# EAGLE design open-lux-R (EAGLE 6.5.0)
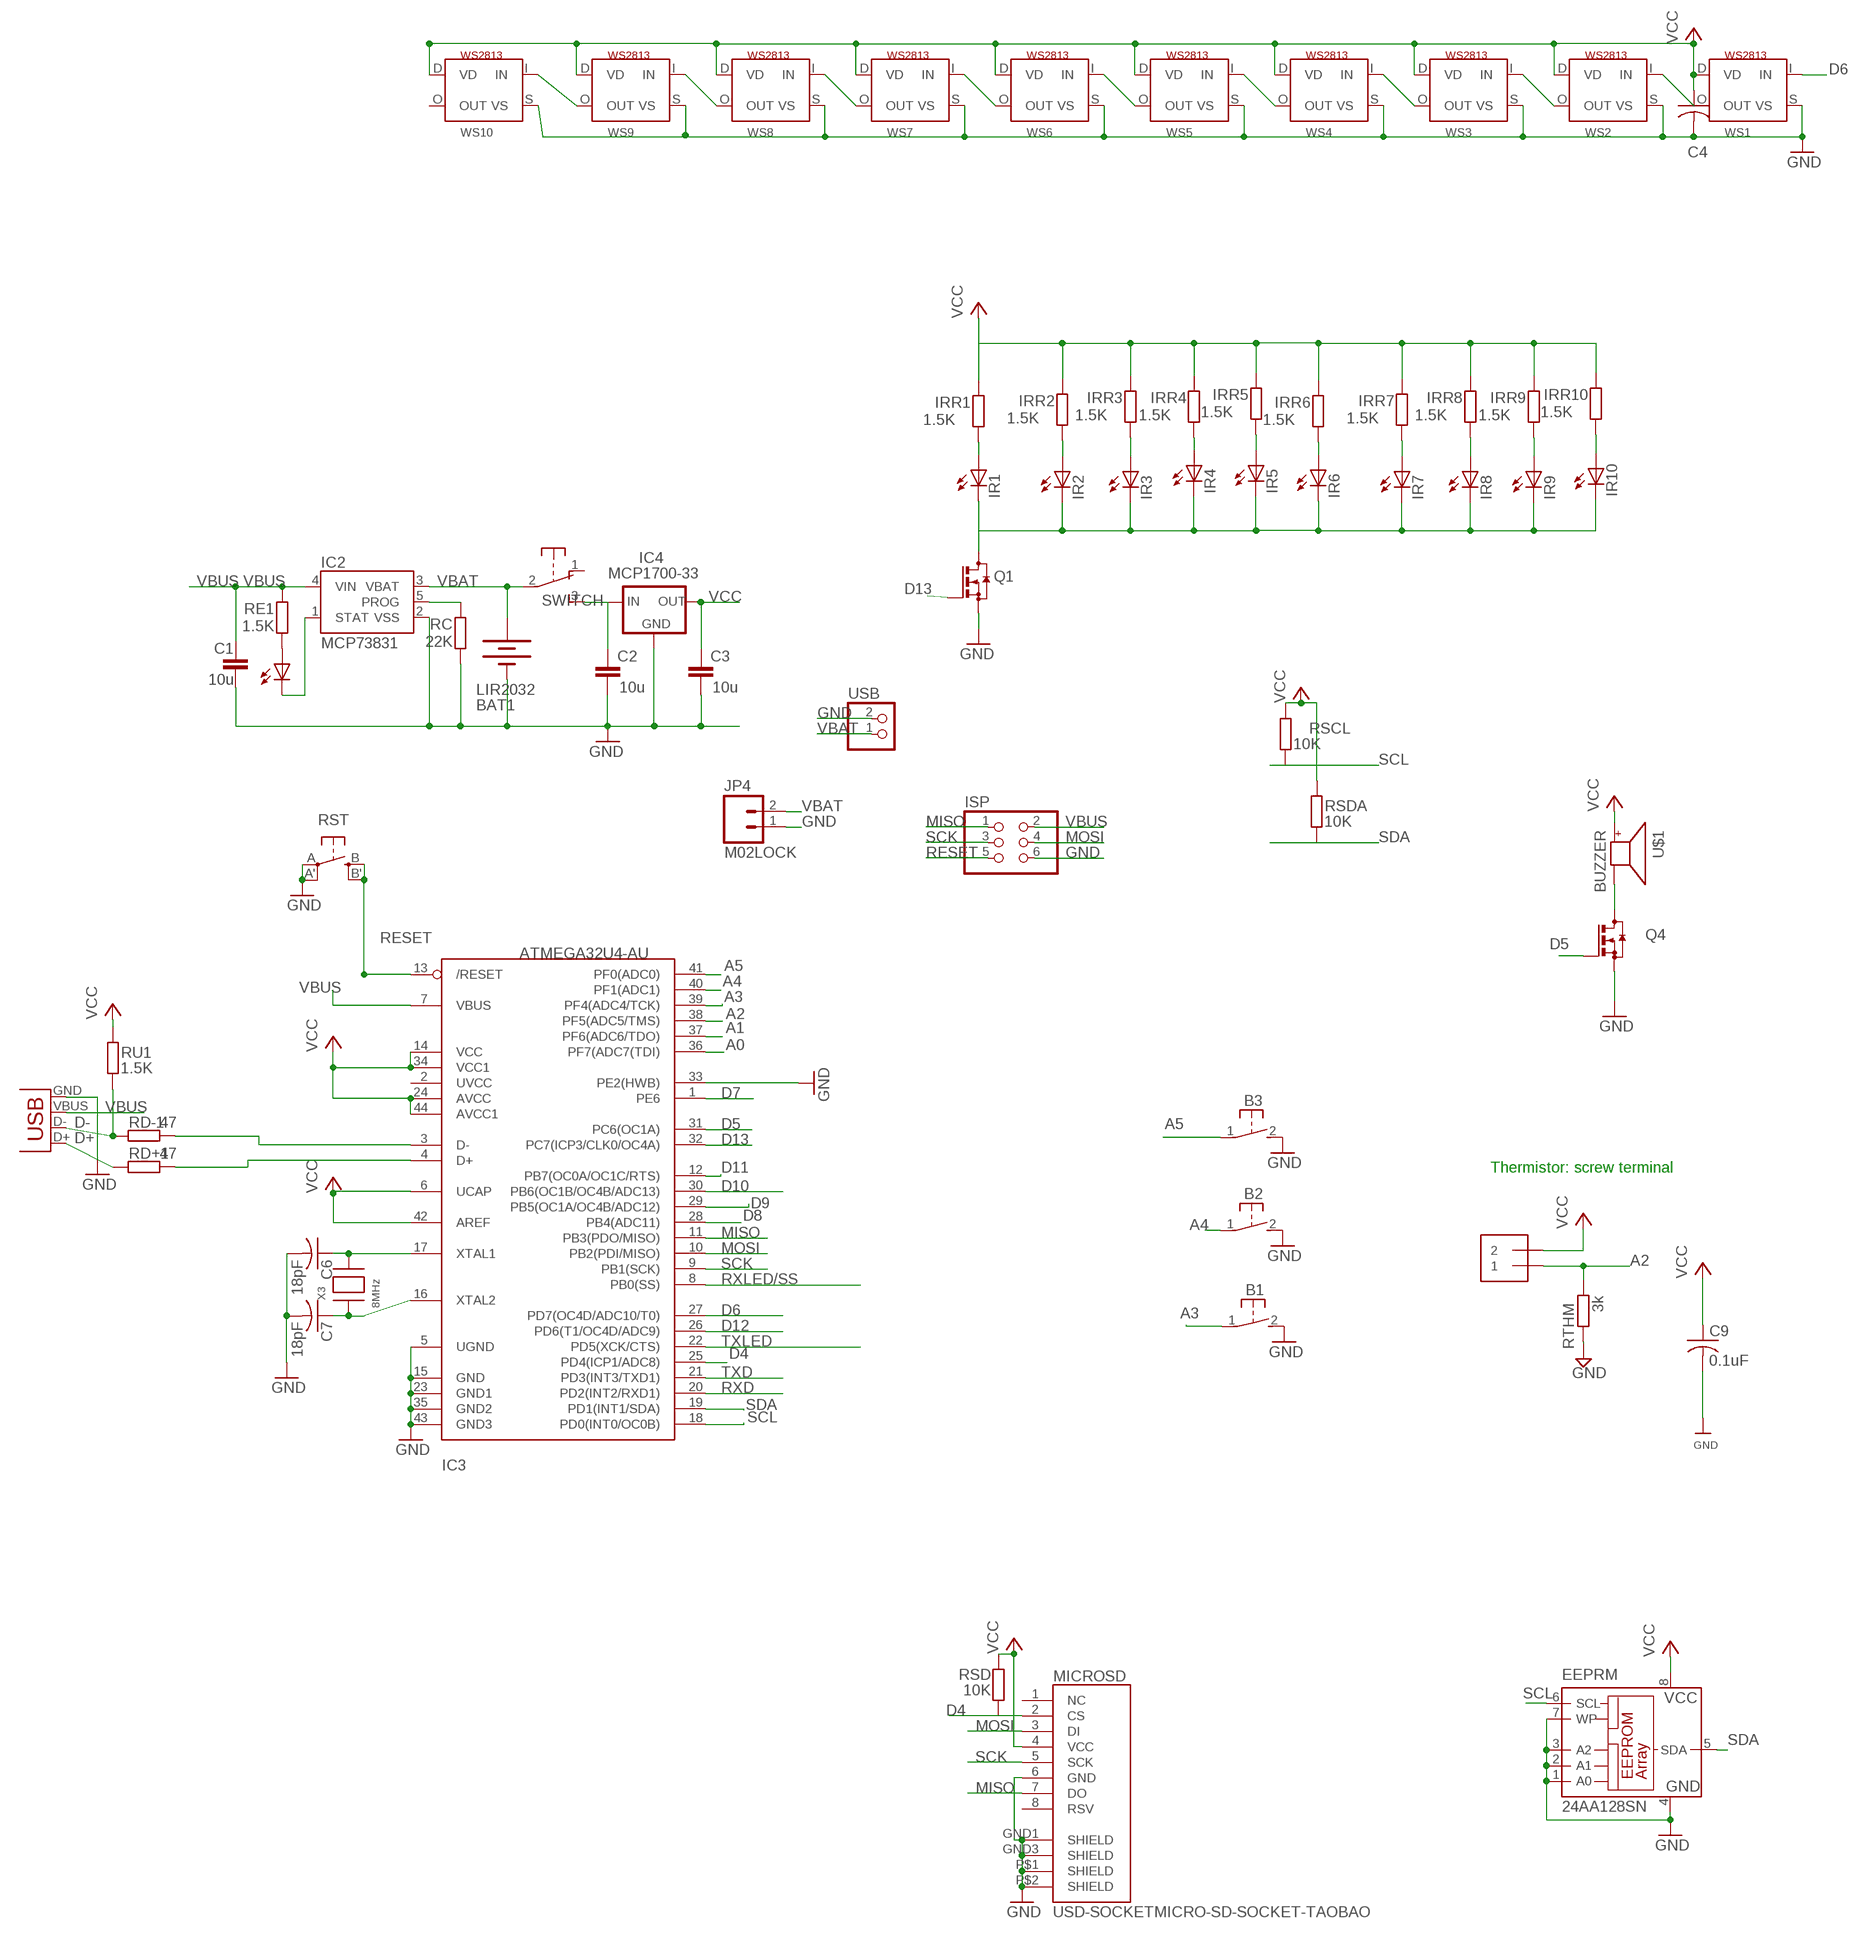
[diagram p0: schematic, sheet 1, part 1 of 2]
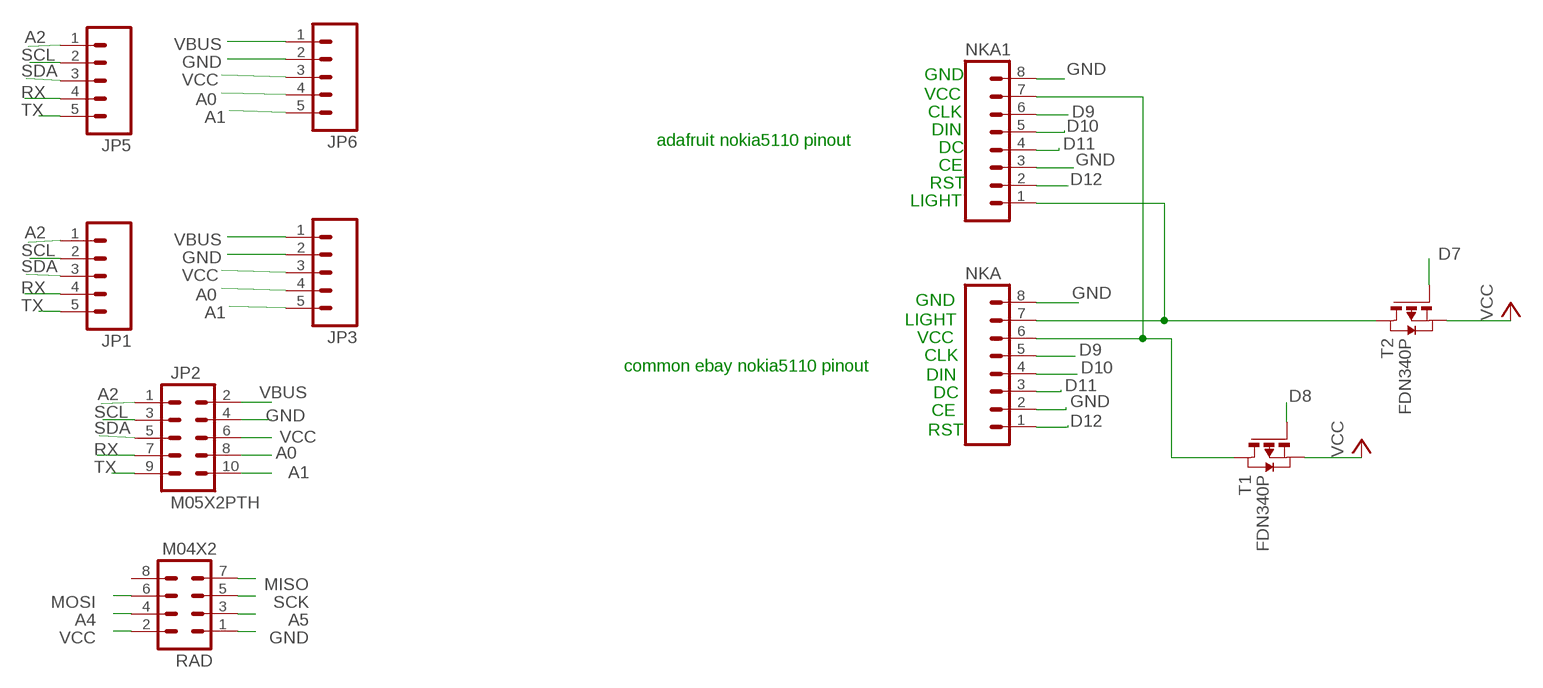
[diagram p1: schematic, sheet 1, part 2 of 2]

## Parts
B1  31-XX  [B3F-31XX]
B2  31-XX  [B3F-31XX]
B3  31-XX  [B3F-31XX]
BAT1  LIR2032  BATTERYBATTCOM_20MM_PTH_SMT  [BATTCOM_20MM_PTH_SMT]
C1  10u  C-EUC0805  [C0805]
C2  10u  C-EUC0805  [C0805]
C3  10u  C-EUC0805  [C0805]
C4  C-USC0805K  [C0805K]
C6  18pF  C-USC0805K  [C0805K]
C7  18pF  C-USC0805K  [C0805K]
C9  0.1uF  C-USC0805  [C0805]
EEPRM  24AA128SN  [SO-08]
IC2  MCP73831  [SOT23-5]
IC3  ATMEGA32U4-AU  [TQFP44]
IC4  MCP1700-33  MCP1700SOT233  [SOT23]
IR1  LEDCHIP-LED0603  [CHIP-LED0603]
IR2  LEDCHIP-LED0603  [CHIP-LED0603]
IR3  LEDCHIP-LED0603  [CHIP-LED0603]
IR4  LEDCHIP-LED0603  [CHIP-LED0603]
IR5  LEDCHIP-LED0603  [CHIP-LED0603]
IR6  LEDCHIP-LED0603  [CHIP-LED0603]
IR7  LEDCHIP-LED0603  [CHIP-LED0603]
IR8  LEDCHIP-LED0603  [CHIP-LED0603]
IR9  LEDCHIP-LED0603  [CHIP-LED0603]
IR10  LEDCHIP-LED0603  [CHIP-LED0603]
IRR1  1.5K  R-EU_R0805  [R0805]
IRR2  1.5K  R-EU_R0805  [R0805]
IRR3  1.5K  R-EU_R0805  [R0805]
IRR4  1.5K  R-EU_R0805  [R0805]
IRR5  1.5K  R-EU_R0805  [R0805]
IRR6  1.5K  R-EU_R0805  [R0805]
IRR7  1.5K  R-EU_R0805  [R0805]
IRR8  1.5K  R-EU_R0805  [R0805]
IRR9  1.5K  R-EU_R0805  [R0805]
IRR10  1.5K  R-EU_R0805  [R0805]
ISP  PINHD-2X3  [2X03]
JP1  M05LOCK  [1X05_LOCK]
JP2  M05X2PTH  [AVR_ICSP]
JP3  M05LOCK  [1X05_LOCK]
JP4  M02LOCK  [1X02_LOCK]
JP5  M05LOCK  [1X05_LOCK]
JP6  M05LOCK  [1X05_LOCK]
MICROSD  USD-SOCKETMICRO-SD-SOCKET-TAOBAO  [MICRO-SD-SOCKET-TAOBAO]
NKA  M08LOCK  [1X08_LOCK]
NKA1  M08LOCK  [1X08_LOCK]
PWR  0805  LEDCHIPLED_0805  [CHIPLED_0805]
Q1  BSS123  [SOT23]
Q4  BSS123  [SOT23]
RAD  M04X2  [2X4]
RC  22K  R-EU_R0805  [R0805]
RD+1  47  R-EU_R0805  [R0805]
RD-1  47  R-EU_R0805  [R0805]
RE1  1.5K  R-EU_R0805  [R0805]
RSCL  10K  R-EU_R0805  [R0805]
RSD  10K  R-EU_R0805  [R0805]
RSDA  10K  R-EU_R0805  [R0805]
RST  EVQQ2  [EVQ-Q2]
RTHM  3k  R-EU_0204/7  [0204/7]
RU1  1.5K  R-EU_R0805  [R0805]
SWITCH  EG1206  [EG1206]
T1  FDN340P  PMOSSOT23  [SOT-23]
T2  FDN340P  PMOSSOT23  [SOT-23]
THM1  1X2-3.5MM  [1X2-3.5MM]
U$1  BUZZER  [SMT-8585-BUZZER]
USB  JST_2PIN-SMT-RA  [JST-PH-2-SMT-RA]
WS1  WS2813  [RGBLED5050_4]
WS2  WS2813  [RGBLED5050_4]
WS3  WS2813  [RGBLED5050_4]
WS4  WS2813  [RGBLED5050_4]
WS5  WS2813  [RGBLED5050_4]
WS6  WS2813  [RGBLED5050_4]
WS7  WS2813  [RGBLED5050_4]
WS8  WS2813  [RGBLED5050_4]
WS9  WS2813  [RGBLED5050_4]
WS10  WS2813  [RGBLED5050_4]
X2  USBSMD  [USB-MINIB]
X3  8MHz  XTALNX5032  [NX5032]

## Nets
A0: IC3.36(PF7(ADC7(TDI)) JP2.8 JP3.4 JP6.4
A1: IC3.37(PF6(ADC6/TDO)) JP2.10 JP3.5 JP6.5
A2: IC3.38(PF5(ADC5/TMS)) JP1.1 JP2.1 JP5.1 RTHM.2 THM1.1
A3: B1.1(P) IC3.39(PF4(ADC4/TCK))
A4: B2.1(P) IC3.40(PF1(ADC1)) RAD.4
A5: B3.1(P) IC3.41(PF0(ADC0)) RAD.3
D4: IC3.25(PD4(ICP1/ADC8)) MICROSD.2(CS) RSD.1
D5: IC3.31(PC6(OC1A)) Q4.1(G)
D6: IC3.27(PD7(OC4D/ADC10/T0)) WS1.I(IN)
D7: IC3.1(PE6) T2.3(G)
D8: IC3.28(PB4(ADC11)) T1.3(G)
D9: IC3.29(PB5(OC1A/OC4B/ADC12)) NKA1.6 NKA.5
D10: IC3.30(PB6(OC1B/OC4B/ADC13)) NKA1.5 NKA.4
D11: IC3.12(PB7(OC0A/OC1C/RTS)) NKA1.4 NKA.3
D12: IC3.26(PD6(T1/OC4D/ADC9)) NKA1.2 NKA.1
D13: IC3.32(PC7(ICP3/CLK0/OC4A)) Q1.1(G)
D+: RD+1.1 X2.D+
D-: RD-1.1 RU1.1 X2.D-
GND: B1.2(S) B2.2(S) B3.2(S) BAT1.P$1(-) C1.2 C2.2 C3.2 C4.2 C6.2 C7.2 C9.2 EEPRM.1(A0) EEPRM.2(A1) EEPRM.3(A2) EEPRM.4(GND) EEPRM.7(WP) IC2.2(VSS) IC3.5(UGND) IC3.15(GND) IC3.23(GND1) IC3.33(PE2(HWB)) IC3.35(GND2) IC3.43(GND3) IC4.1(GND) ISP.6 JP2.4 JP3.2 JP4.1 JP6.2 MICROSD.6(GND) MICROSD.GND1(SHIELD) MICROSD.GND3(SHIELD) MICROSD.P$1(SHIELD) MICROSD.P$2(SHIELD) NKA1.3 NKA1.8 NKA.2 NKA.8 Q1.2(S) Q4.2(S) RAD.1 RC.1 RST.A'(P1) RST.A(P) RTHM.1 USB.2 WS1.S(VS) WS2.S(VS) WS3.S(VS) WS4.S(VS) WS5.S(VS) WS6.S(VS) WS7.S(VS) WS8.S(VS) WS9.S(VS) WS10.S(VS) X2.GND
MISO: IC3.11(PB3(PDO/MISO)) ISP.1 MICROSD.7(DO) RAD.7
MOSI: IC3.10(PB2(PDI/MISO)) ISP.4 MICROSD.3(DI) RAD.6
N$1: C2.1 IC4.3(IN) SWITCH.3(S)
N$2: C7.1 IC3.16(XTAL2) X3.P$1
N$3: C6.1 IC3.17(XTAL1) X3.P$2
N$4: WS9.O(OUT) WS10.I(IN)
N$5: IC2.1(STAT) PWR.C
N$6: IC2.5(PROG) RC.2
N$7: Q4.3(D) U$1.-
N$8: IR1.C IR2.C IR3.C IR4.C IR5.C IR6.C IR7.C IR8.C IR9.C IR10.C Q1.3(D)
N$9: T2.1(D)
N$10: PWR.A RE1.1
N$11: IR1.A IRR1.1
N$12: NKA1.1 NKA.7
N$13: IR2.A IRR2.1
N$14: WS6.O(OUT) WS7.I(IN)
N$15: IR3.A IRR3.1
N$16: IR6.A IRR6.1
N$17: IR4.A IRR4.1
N$18: IR5.A IRR5.1
N$19: WS4.O(OUT) WS5.I(IN)
N$20: WS5.O(OUT) WS6.I(IN)
N$21: IC3.4(D+) RD+1.2
N$22: IC3.3(D-) RD-1.2
N$23: WS1.O(OUT) WS2.I(IN)
N$24: WS2.O(OUT) WS3.I(IN)
N$25: WS3.O(OUT) WS4.I(IN)
N$26: IR7.A IRR7.1
N$27: WS8.O(OUT) WS9.I(IN)
N$28: WS7.O(OUT) WS8.I(IN)
N$29: IR8.A IRR8.1
N$30: IR9.A IRR9.1
N$31: NKA1.7 NKA.6 T1.1(D)
N$32: IR10.A IRR10.1
RESET: IC3.13(/RESET) ISP.5 RST.B'(S1) RST.B(S)
RX: JP1.4 JP2.7 JP5.4
RXD: IC3.20(PD2(INT2/RXD1))
RXLED/SS: IC3.8(PB0(SS))
SCK: IC3.9(PB1(SCK)) ISP.3 MICROSD.5(SCK) RAD.5
SCL: EEPRM.6(SCL) IC3.18(PD0(INT0/OC0B)) JP1.2 JP2.3 JP5.2 RSCL.1
SDA: EEPRM.5(SDA) IC3.19(PD1(INT1/SDA)) JP1.3 JP2.5 JP5.3 RSDA.1
TX: JP1.5 JP2.9 JP5.5
TXD: IC3.21(PD3(INT3/TXD1))
TXLED: IC3.22(PD5(XCK/CTS))
VBAT: BAT1.P$2(+) IC2.3(VBAT) JP4.2 SWITCH.2(P) USB.1
VBUS: C1.1 IC2.4(VIN) IC3.7(VBUS) ISP.2 JP2.2 JP3.1 JP6.1 RE1.2 X2.VBUS
VCC: C3.1 C4.1 C9.1 EEPRM.8(VCC) IC3.6(UCAP) IC3.14(VCC) IC3.24(AVCC) IC3.34(VCC1) IC3.42(AREF) IC3.44(AVCC1) IC4.2(OUT) IRR1.2 IRR2.2 IRR3.2 IRR4.2 IRR5.2 IRR6.2 IRR7.2 IRR8.2 IRR9.2 IRR10.2 JP2.6 JP3.3 JP6.3 MICROSD.4(VCC) RAD.2 RSCL.2 RSD.2 RSDA.2 RU1.2 T1.2(S) T2.2(S) THM1.2 U$1.+ WS1.D(VD) WS2.D(VD) WS3.D(VD) WS4.D(VD) WS5.D(VD) WS6.D(VD) WS7.D(VD) WS8.D(VD) WS9.D(VD) WS10.D(VD)
Unconnected: IC3.2(UVCC) MICROSD.1(NC) MICROSD.8(RSV) RAD.8 SWITCH.1(O) WS10.O(OUT)

## Notes on the sheet
- GND
- VCC
- CLK
- adafruit nokia5110 pinout | DIN
- DC
- CE
- RST
- LIGHT
- GND
- LIGHT
- VCC
- common ebay nokia5110 pinout | CLK
- DIN
- DC
- CE
- RST
- Thermistor: screw terminal

## Library data of the parts
B1-B3 = adafruit:31-XX: OMRON SWITCH Now with beefier pads!
BAT1 = SparkFunNew:BATTERY: Battery Holders Various common sizes : AA, AAA, 20mm coin cell and 12mm coin cell.
C1-C3 = resistor:C-EU: CAPACITOR, European symbol
C4 = adafruit2013:C-US: CAPACITOR, American symbol
C6 C7 C9 = adafruit:C-US: CAPACITOR, American symbol
EEPRM = microchip:24*: Serial EEPROM I2C; MF: MICROCHIP; MPN: 24AA128-I/SN; OC_FARNELL: unknown; OC_NEWARK: 92C6842
IC2 = SparkFunNew:MCP73831: Microchip's MCP73831 Miniature single cell, fully integrated Li-Ion, Li-polymer charge management controller http://ww1.microchip.com/downloads/en/DeviceDoc/21984a.pdf
IC3 = adaprog:ATMEGA32U4
IC4 = adafruit:MCP1700: VOLTAGE REGULATOR
IR1-IR10 = adafruit:LED: LED
IRR1-IRR10 RC RD+1 RD-1 RE1 RSCL RSD RSDA RTHM RU1 = rcl:R-EU_: RESISTOR, European symbol
ISP = pinhead:PINHD-2X3: PIN HEADER
JP1 JP3 JP5 JP6 = SparkFun-Connectors:M05: Header 5 Standard 5-pin 0.1" header. Use with straight break away headers (SKU : PRT-00116), right angle break away headers (PRT-00553), swiss pins (PRT-00743), machine pins (PRT-00117), and female headers (PRT-00115). Molex polarized connector foot print use with SKU : PRT-08230 with associated crimp pins and housings.
JP2 = SparkFun-Connectors:M05X2: Header 5x2 Standard 10-pin dual row 0.1" header. Commonly used with AVR-ISP. Use with Spark Fun Electronics SKU: PRT-00778
JP4 = SparkFun-Connectors:M02: Standard 2-pin 0.1" header. Use with - straight break away headers ( PRT-00116) - right angle break away headers (PRT-00553) - swiss pins (PRT-00743) - machine pins (PRT-00117) - female headers (PRT-00115) Molex polarized connector foot print use with: PRT-08233 with associated crimp pins and housings. 2.54_SCREWTERM for use with PRT-10571. 3.5mm Screw Terminal footprints for PRT-08084 5mm Screw Terminal footprints for use with PRT-08433
MICROSD = SparkFunNew:USD-SOCKET: microSD Socket Push-push type uSD socket. Schematic element and footprint production proven. Spark Fun Electronics SKU : PRT-00127. tDoc lines correctly indicate media card edge positions when inserting (unlocked, locked, depressed).
NKA NKA1 = SparkFun-Connectors:M08: Header 8 Standard 8-pin 0.1" header. Use with straight break away headers (SKU : PRT-00116), right angle break away headers (PRT-00553), swiss pins (PRT-00743), machine pins (PRT-00117), and female headers (PRT-00115).
PWR = led:LED: LED
Q1 Q4 = transistor-small-signal:BSS123: N-CHANNEL MOS FET
RAD = SparkFun-Connectors:M04X2: .1" header, two rows of four.
RST = adafruit:EVQQ2: SMT 6mm switch, EVQQ2 series http://www.ladyada.net/library/eagle
SWITCH = adafruit:EG1206
T1 T2 = zetex:PMOSSOT23: MOS FET
THM1 = adafruit:1X2: 3.5mm Terminal block http://www.ladyada.net/library/pcb/eaglelibrary.html
U$1 = adafruit:BUZZER
USB = adafruit:JST_2PIN: JST 2-Pin Connectors of various flavors SMT-RA (S2B-PH-SM4) 4UConnector #17311 SMT (B2B-PH-SM4) THM-RA (S2B-PH) THM (B2B-PH)
WS1-WS10 = adafruit:WS2813
X2 = SparkFun:USB: USB Connectors USB-B-PTH is fully proven SKU : PRT-00139 USB-miniB is fully proven SKU : PRT-00587 USB-A-PCB is untested. USB-A-H is throughly reviewed, but untested. Spark Fun Electronics SKU : PRT-00437 USB-B-SMT is throughly reviewed, but untested. Needs silkscreen touching up. USB-A-S has not been used/tested USB-MB-H has not been used/tested
X3 = adaprog:XTAL

## Net classes
1 power: width 0.813 mm, clearance 0.203 mm

## Board
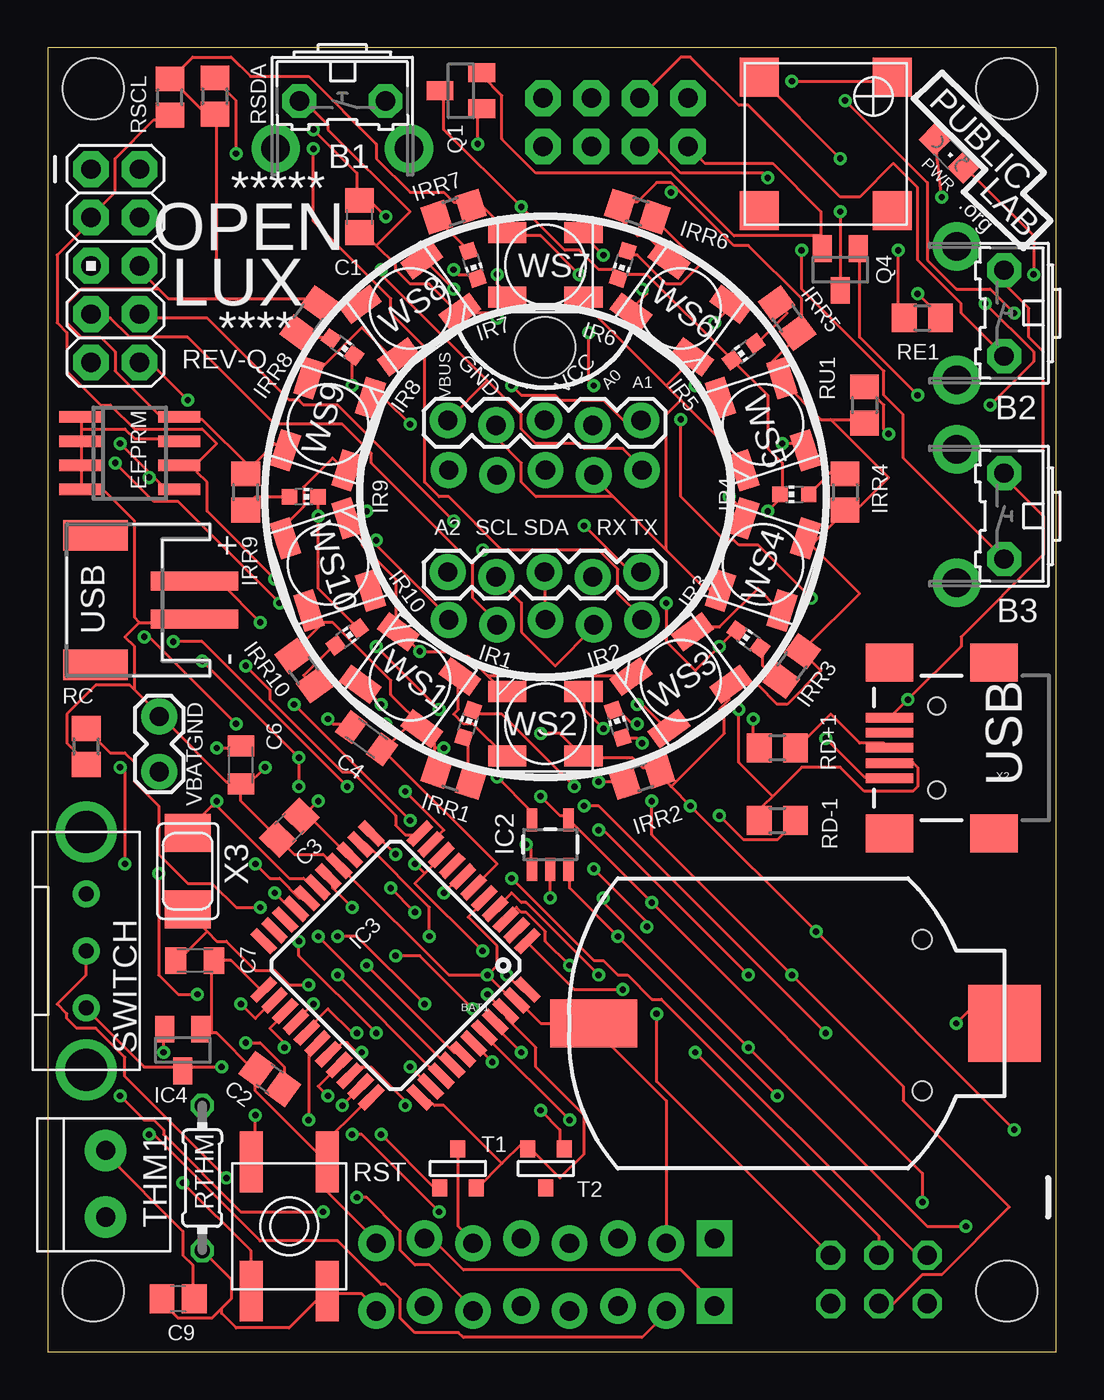
[diagram p2: board, top side]
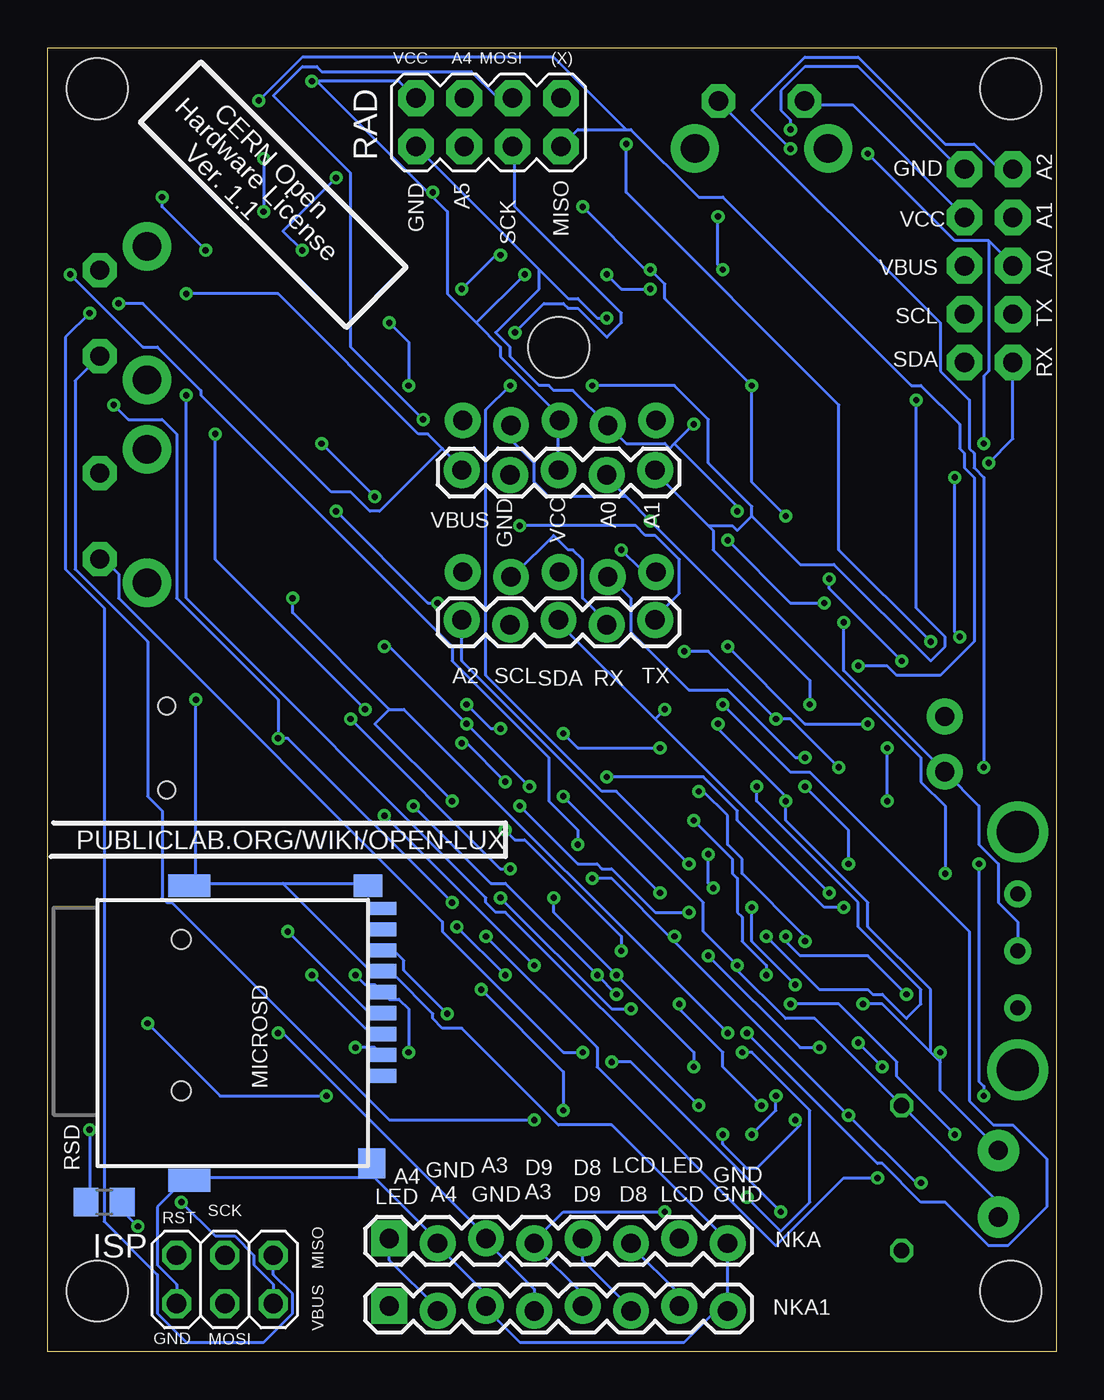
[diagram p3: board, bottom side, seen from below]

Size 53.01 x 68.57 mm. Coordinates in mm from the lower left corner, seen from the top.
Outline: 0,0 53.01,0 53.01,68.57 0,68.57 0,0
Copper layers (1*16): Top 0.0356mm / dielectric 1.5011mm / Bottom 0.0356mm
Design rules "LaenPCBOrder": minimum track width 6mil, minimum drill 13mil, track to track 6mil, track to pad 6mil, pad to pad 6mil, via to via 6mil, smd to smd 6mil, copper to edge 15mil, drill to drill 6mil, minimum pad ring 7mil, minimum via ring 7mil, stop-mask expansion 3mil, vias tented up to drill 0mil, thermal gap 10mil
Holes 3.2 mm at 2.4,66.4 50.4,3.2 50.4,66.4 2.4,3.2 26.14,52.81

### Footprints (pad centres in the part's own frame; a part is rotated, then mirrored left to right if it is on the bottom)
B3F-31XX = drill 1.016 pad 1.778 octagon: 1 -2.261,-1.245; 2 2.261,-1.245 | drill 1.499 pad 2.54: 3 -3.505,1.245; 4 3.505,1.245
BATTCOM_20MM_PTH_SMT = smd 4.572 x 2.54: P$1 0,0 | smd 3.81 x 4.064: P$2 21.59,0
C0805 = smd 1.3 x 1.5: 1 -0.85,0; 2 0.85,0
C0805K = smd 1.1 x 1.4: 1 -1,0; 2 1,0
SO-08 = smd 0.6 x 2.2: 1 -1.905,-2.6; 2 -0.635,-2.6; 3 0.635,-2.6; 4 1.905,-2.6; 5 1.905,2.6; 6 0.635,2.6; 7 -0.635,2.6; 8 -1.905,2.6
SOT23-5 = smd 0.55 x 1.2: 1 -0.95,-1.3; 2 0,-1.3; 3 0.95,-1.3; 4 0.95,1.3; 5 -0.95,1.3
TQFP44 = smd 1.5 x 0.5: 1 -5.8,4; 2 -5.8,3.2; 3 -5.8,2.4; 4 -5.8,1.6; 5 -5.8,0.8; 6 -5.8,0; 7 -5.8,-0.8; 8 -5.8,-1.6; 9 -5.8,-2.4; 10 -5.8,-3.2; 11 -5.8,-4; 23 5.8,-4; 24 5.8,-3.2; 25 5.8,-2.4; 26 5.8,-1.6; 27 5.8,-0.8; 28 5.8,0; 29 5.8,0.8; 30 5.8,1.6; 31 5.8,2.4; 32 5.8,3.2; 33 5.8,4 | smd 0.5 x 1.5: 12 -4,-5.8; 13 -3.2,-5.8; 14 -2.4,-5.8; 15 -1.6,-5.8; 16 -0.8,-5.8; 17 0,-5.8; 18 0.8,-5.8; 19 1.6,-5.8; 20 2.4,-5.8; 21 3.2,-5.8; 22 4,-5.8; 34 4,5.8; 35 3.2,5.8; 36 2.4,5.8; 37 1.6,5.8; 38 0.8,5.8; 39 0,5.8; 40 -0.8,5.8; 41 -1.6,5.8; 42 -2.4,5.8; 43 -3.2,5.8; 44 -4,5.8
SOT23 = smd 1 x 1.4: 1 -0.95,-1.1; 2 0.95,-1.1; 3 0,1.1
CHIP-LED0603 = smd 0.8 x 0.8: A 0,-0.75; C 0,0.75
R0805 = smd 1.3 x 1.5: 1 -0.95,0; 2 0.95,0
2X03 = drill 1.016 octagon: 1 -2.54,-1.27; 2 -2.54,1.27; 3 0,-1.27; 4 0,1.27; 5 2.54,-1.27; 6 2.54,1.27
1X05_LOCK = drill 1.016 pad 1.88: 1 0,0.127; 2 2.54,-0.127; 3 5.08,0.127; 4 7.62,-0.127; 5 10.16,0.127
AVR_ICSP = drill 1.016 pad 1.88 octagon: 1 -1.27,5.08; 2 1.27,5.08; 3 -1.27,2.54; 4 1.27,2.54; 5 -1.27,0; 6 1.27,0; 7 -1.27,-2.54; 8 1.27,-2.54; 9 -1.27,-5.08; 10 1.27,-5.08
1X02_LOCK = drill 1.016 pad 1.88: 1 -0.178,0; 2 2.718,0
MICRO-SD-SOCKET-TAOBAO = smd 0.75 x 1.6: 1 2.25,10.5; 2 1.15,10.5; 3 0.05,10.5; 4 -1.05,10.5; 5 -2.15,10.5; 6 -3.25,10.5; 7 -4.35,10.5; 8 -5.45,10.5 | smd 0.7 x 1.6: CD -6.55,10.5 | smd 1.2 x 1.5: GND1 -7.75,9.8 | smd 1.6 x 1.4: GND3 6.85,10 | smd 1.2 x 2.2: P$1 7.75,0.4; P$2 -7.75,0.4 | hole 1: 3.05,0; -4.93,0
1X08_LOCK = drill 1.016 pad 1.88 square: 1 0,0.127 | drill 1.016 pad 1.88: 2 2.54,-0.127; 3 5.08,0.127; 4 7.62,-0.127; 5 10.16,0.127; 6 12.7,-0.127; 7 15.24,0.127; 8 17.78,-0.127
CHIPLED_0805 = smd 1.2 x 1.2: A 0,-1.05; C 0,1.05
2X4 = drill 1.016 pad 1.88 octagon: 1 -3.81,-1.27; 2 -3.81,1.27; 3 -1.27,-1.27; 4 -1.27,1.27; 5 1.27,-1.27; 6 1.27,1.27; 7 3.81,-1.27; 8 3.81,1.27
EVQ-Q2 = smd 3.2 x 1.2: A -3.4,-2; A' 3.4,-2; B -3.4,2; B' 3.4,2
0204/7 = drill 0.813 octagon: 1 -3.81,0; 2 3.81,0
EG1206 = drill 0.8 pad 1.422: 1 -3,0; 2 0,0; 3 3,0 | drill 2.2: MT1 -6.25,0; MT2 6.25,0
SOT-23 = smd 0.787 x 0.889: 1 0.025,-1.016; 2 -0.94,1.016; 3 0.991,1.016
1X2-3.5MM = drill 1 pad 2.184: 1 1.8,0; 2 -1.7,0
SMT-8585-BUZZER = smd 2.05 x 2.05: + -3.5,-3.5; - 3.5,-3.5; NC1 -3.5,3.5; NC2 3.5,3.5
JST-PH-2-SMT-RA = smd 1 x 4.6: 1 1,-3.7; 2 -1,-3.7 | smd 1.6 x 3.4: NC1 -3.4,1.5; NC2 3.4,1.5
RGBLED5050_4 = smd 2 x 1.1: D -2,1.7; I 2,1.7; O -2,-1.7; S 2,-1.7
USB-MINIB = smd 2.5 x 0.5: D+ 2.5,0; D- 2.5,0.8; GND 2.5,-1.6; ID 2.5,-0.8; VBUS 2.5,1.6 | smd 2.5 x 2: GND@1 -3,-4.5; GND@2 -3,4.5; GND@3 2.5,4.5; GND@4 2.5,-4.5 | hole 0.9: 0,2.2; 0,-2.2
NX5032 = smd 2 x 2.4: P$1 2,0; P$2 -2,0

### Placement (x,y rotation side)
B1  15.49,64.52 180 top
B2  49.02,54.61 90 top
B3  49.02,43.94 90 top
BAT1  28.7,17.27 0 top
C1  16.38,59.69 270 top
C2  11.68,14.35 144 top
C3  12.7,27.56 225 top
C4  16.76,32.26 144 top
C6  10.16,30.86 270 top
C7  7.75,20.57 0 top
C9  6.86,2.79 180 top
EEPRM  4.32,47.24 270 top
IC2  26.42,26.67 0 top
IC3  18.29,20.32 225 top
IC4  7.11,15.88 180 top
IR1  22.1,33.02 342 top
IR2  29.97,33.02 18 top
IR3  36.83,37.47 54 top
IR4  39.24,45.09 90 top
IR5  36.58,52.58 126 top
IR6  30.23,57.15 162 top
IR7  22.35,57.15 198 top
IR8  15.49,52.83 234 top
IR9  13.46,44.96 270 top
IR10  15.75,37.59 306 top
IRR1  21.34,30.23 162 top
IRR2  31.24,30.23 18 top
IRR3  39.12,36.07 54 top
IRR4  41.91,45.21 270 top
IRR5  38.86,54.36 306 top
IRR6  30.99,59.94 162 top
IRR7  21.34,59.94 18 top
IRR8  13.72,54.36 54 top
IRR9  10.41,45.21 90 top
IRR10  13.46,35.81 126 top
ISP  43.69,3.81 180 bottom
JP1  21.03,40.87 0 top
JP2  3.56,57.1 0 top
JP3  21.03,48.84 0 top
JP4  5.87,33.22 270 top
JP5  31.24,38.35 0 bottom
JP6  31.24,46.23 0 bottom
MICROSD  45.97,16.76 270 bottom
NKA  35.05,5.84 0 bottom
NKA1  35.05,2.29 0 bottom
PWR  47.37,62.99 225 top
Q1  21.72,66.29 90 top
Q4  41.66,56.9 180 top
RAD  29.84,64.64 0 bottom
RC  2.03,31.83 90 top
RD+1  38.35,31.75 180 top
RD-1  38.35,27.94 0 top
RE1  45.97,54.36 0 top
RSCL  6.43,65.96 90 top
RSD  50.04,7.87 180 bottom
RSDA  8.79,66.01 270 top
RST  12.7,6.6 90 top
RTHM  8.13,9.14 90 top
RU1  42.93,49.78 270 top
SWITCH  2.03,21.08 270 top
T1  21.59,9.65 180 top
T2  26.16,9.65 0 top
THM1  3.05,8.89 270 top
U$1  40.89,63.5 180 top
USB  4.01,39.52 90 top
WS1  19.05,35.31 144 top
WS2  26.16,33.02 180 top
WS3  33.27,35.31 216 top
WS4  37.59,41.4 252 top
WS5  37.59,48.77 288 top
WS6  33.27,54.86 324 top
WS7  26.16,57.15 0 top
WS8  19.05,54.86 36 top
WS9  14.73,48.77 72 top
WS10  14.73,41.4 108 top
X2  46.74,31.75 180 top
X3  7.37,25.27 270 top

### Tracks (layer width: path | path; a pad name or v marks a point on that pad's centre or on a via)
A0  (via drill 0.33)
  Top 0.152: v15.24,19.81 20.32,14.73 20.57,14.73 IC3.36 | v12.95,34.04 v19.05,27.94 | v21.34,43.69 15.24,49.78 13.46,49.78 13.21,50.04 12.7,50.04 8.38,54.36 4.83,54.36 JP2.8
  Bottom 0.152: v15.24,19.81 15.24,20.32 16.51,21.59 16.51,22.86 16.76,23.11 16.76,24.89 17.02,25.15 17.02,25.91 v19.05,27.94 | v12.95,34.04 12.95,35.31 v21.34,43.69 22.61,44.96 | 22.61,44.96 23.62,45.97 JP6.4 | 22.61,44.96 26.67,44.96 27.43,45.72 27.43,46.74 28.45,47.75 28.45,48.51 JP3.4
A1  (via drill 0.33)
  Top 0.152: v14.22,21.84 20.83,15.24 21.08,15.24 IC3.37 | v7.87,18.8 6.86,18.8 5.84,19.81 v5.84,25.15 | v24.38,50.8 24.89,50.29 26.67,50.29 26.92,50.04 29.21,50.04 30.23,49.02 30.99,49.02 JP3.5 | v7.37,50.04 5.59,51.82 4.83,51.82 JP2.10
  Bottom 0.152: v14.22,21.84 14.22,21.59 13.46,20.83 9.91,20.83 v7.87,18.8 | v5.84,25.15 5.84,28.7 7.11,29.97 7.11,31.24 18.03,42.16 18.03,43.18 18.29,43.43 | 18.29,43.43 21.08,46.23 JP6.5 | v24.38,50.8 20.07,50.8 18.29,49.02 18.29,46.74 16,44.45 16,43.94 | 16,43.94 16.76,43.18 17.02,43.43 18.29,43.43 | v7.37,50.04 7.37,39.12 5.84,37.59 5.84,37.08 6.6,36.32 11.68,41.4 13.46,41.4 16,43.94
A2  (via drill 0.33)
  Top 0.152: v16.76,20.32 21.34,15.75 21.59,15.75 IC3.38 | 23.88,42.16 28.96,42.16 29.97,41.15 29.97,39.88 31.24,38.61 JP5.1 | 23.88,42.16 v22.86,42.16 | v13.97,63.25 13.97,59.44 18.03,55.37 18.03,54.61 19.81,52.83 19.81,45.72 20.57,44.96 21.08,44.96 23.88,42.16
  Bottom 0.152: JP5.1 31.24,36.32 18.54,23.62 18.54,22.1 v16.76,20.32 16.76,20.07 14.22,17.53 12.7,17.53 RTHM.2 3.05,7.87 THM1.1 | v22.86,42.16 21.84,41.15 21.08,41.15 JP1.1 | v13.97,63.25 16,65.28 13.21,68.07 10.41,68.07 5.84,63.5 4.32,63.5 3.05,62.23 2.29,62.23 JP2.1
A3  (via drill 0.33)
  Top 0.152: v23.37,15.24 22.61,16 IC3.39 | v14.48,7.37 10.16,7.37 6.1,11.43 6.1,11.68 5.59,12.19 5.08,12.19 v3.81,13.46 | v4.06,25.65 4.06,30.48 v3.81,30.73
  Bottom 0.152: v23.37,15.24 22.35,15.24 v14.48,7.37 | v3.81,13.46 3.81,13.97 4.06,14.22 v4.06,25.65 | v3.81,30.73 3.81,45.97 4.32,46.48 4.32,47.24 4.57,47.5 4.57,50.04 6.1,51.56 6.1,54.1 B1.1
A4  (via drill 0.33)
  Top 0.152: v27.43,12.19 23.11,16.51 23.11,16.76 IC3.40 | RAD.4 33.27,68.07 33.78,68.07 36.32,65.53 36.83,65.53 41.66,60.71 42.67,60.71 44.45,62.48 45.72,61.21 45.72,57.4 48.01,55.12 48.01,54.61 B2.1
  Bottom 0.152: v27.43,12.19 35.05,12.19 46.48,23.62 46.74,23.62 46.99,23.88 46.99,28.45 47.75,29.21 47.75,37.34 51.56,41.15 51.56,51.05 B2.1
A5  (via drill 0.33)
  Top 0.152: v24.89,15.75 23.62,17.02 23.62,17.27 IC3.41 | v37.85,61.72 37.59,61.98 33.27,61.98 32,63.25 31.24,63.25 RAD.3 | v39.62,57.91 39.62,55.88 43.94,51.56 43.94,50.29 44.96,49.28 44.96,46.99 B3.1
  Bottom 0.152: v24.89,15.75 25.91,15.75 32.26,22.1 32.26,22.61 49.28,39.62 49.28,40.89 50.04,41.66 B3.1 | v37.85,61.72 40.64,58.93 v39.62,57.91
D4  (via drill 0.33)
  Top 0.152: v12.45,16 12.45,16.26 11.68,17.02 12.45,17.78 IC3.25 | v18.29,20.83 19.56,20.83 v22.35,18.03 | v29.21,23.88 29.21,23.62 v36.83,16 46.23,6.6 v48.26,6.6
  Bottom 0.152: v12.45,16 13.46,16 v18.29,20.83 | v22.35,18.03 23.37,18.03 v29.21,23.88 | v36.83,16 35.81,16 35.56,15.75 MICROSD.2 | v48.26,6.6 49.02,7.37 49.02,7.87 RSD.1
D5  (via drill 0.33)
  Top 0.152: v45.72,50.29 42.67,53.34 42.67,57.91 Q4.1 | v18.8,12.95 18.8,13.21 17.02,14.99 16.26,14.99 16,14.73 IC3.31
  Bottom 0.152: v45.72,50.29 45.72,39.62 29.97,23.88 29.97,23.62 29.46,23.11 28.96,23.11 v18.8,12.95
D6  (via drill 0.33)
  Top 0.152: v16.26,16.76 16,16.76 14.73,18.03 13.72,17.02 IC3.27 | v17.53,34.04 16.51,35.05 WS1.I
  Bottom 0.152: v16.26,16.76 9.4,9.91 9.14,9.91 7.11,7.87 5.84,7.87 3.56,5.59 2.54,5.59 0.51,7.62 0.51,10.16 2.29,11.94 3.3,11.94 4.57,13.21 4.57,22.1 12.95,30.48 13.97,30.48 v17.53,34.04
D7  (via drill 0.33)
  Top 0.152: v25.91,12.7 26.92,11.68 26.92,10.67 T2.3 | v30.23,19.05 27.69,19.05 25.15,21.59 IC3.1
  Bottom 0.152: v25.91,12.7 25.91,14.73 v30.23,19.05
D8  (via drill 0.33)
  Top 0.152: T1.3 20.32,8.64 v17.53,11.43 | v13.72,12.19 13.72,15.75 IC3.28
  Bottom 0.152: v17.53,11.43 17.53,10.92 16.26,9.65 15.75,9.65 13.46,11.94 v13.72,12.19
D9  (via drill 0.33)
  Top 0.152: v16.51,15.75 16.26,15.75 15.75,16.26 15.49,16.26 14.99,15.75 IC3.29 | v16.26,8.13 16.76,8.13 18.54,6.35 18.54,5.33 19.3,4.57 20.07,4.57 22.35,2.29 NKA1.6
  Bottom 0.152: v16.51,15.75 16,15.75 12.95,12.7 12.95,7.87 14.48,6.35 v16.26,8.13 | NKA.5 24.89,4.83 22.35,2.29 NKA1.6
D10  (via drill 0.33)
  Top 0.152: v14.73,13.46 14.22,13.97 15.24,14.99 IC3.30 | v16,11.43 16.51,11.43 v20.57,7.37
  Bottom 0.152: v14.73,13.46 14.73,12.7 v16,11.43 | v20.57,7.37 25.91,7.37 27.43,5.84 NKA.4 27.43,5.59 24.89,3.05 NKA1.5
D11  (via drill 0.33)
  Top 0.152: v18.29,26.16 17.27,27.18 17.02,27.18 IC3.12 | v19.3,23.11 v18.03,24.38 | v28.19,28.7 28.96,28.7 v40.89,16.76
  Bottom 0.152: v18.29,26.16 18.29,24.64 v18.03,24.38 | v19.3,23.11 21.08,23.11 23.37,25.4 23.88,25.4 24.13,25.65 25.15,25.65 v28.19,28.7 | v40.89,16.76 40.64,16.76 29.97,6.1 NKA.3 29.97,5.84 27.43,3.3 NKA1.4
D12  (via drill 0.33)
  Top 0.152: v13.97,18.29 13.21,17.53 IC3.26 | v5.33,11.43 5.59,11.43 11.18,5.84 15.24,5.84 17.53,3.56 17.78,3.56 18.54,2.79 18.54,1.78 19.3,1.02 21.59,1.02 21.84,0.76 31.24,0.76 32.51,2.03 NKA1.2
  Bottom 0.152: v13.97,18.29 11.43,18.29 8.38,15.24 8.38,14.48 v5.33,11.43 | NKA.1 35.05,4.83 32.51,2.29 NKA1.2
D13  (via drill 0.33)
  Top 0.152: v22.61,63.5 22.61,65.28 Q1.1 | v6.6,37.34 8.13,37.34 v15.75,29.72 | v15.24,21.84 16.26,21.84 v19.81,18.29 | v15.49,12.95 16.26,13.72 IC3.32
  Bottom 0.152: v22.61,63.5 22.61,60.96 11.43,49.78 11.43,42.16 v6.6,37.34 | v15.75,29.72 15.75,28.96 10.41,23.62 10.41,22.35 7.11,19.05 7.11,18.29 7.87,17.53 9.14,18.8 9.65,18.8 9.91,19.05 12.45,19.05 v15.24,21.84 | v19.81,18.29 19.81,18.03 17.53,15.75 17.53,14.99 v15.49,12.95
D+
  Top 0.152: RD+1.1 39.37,31.75 41.15,33.53 42.67,32 43.94,32 44.2,31.75 X2.D+
D-  (via drill 0.33)
  Top 0.152: 38.1,29.21 39.62,30.73 41.66,30.73 42.93,29.46 45.47,29.46 45.72,29.72 45.72,30.73 45.47,30.99 44.45,30.99 X2.D- | 38.1,29.21 37.59,28.7 37.59,27.94 RD-1.1 | v44.2,48.26 43.94,48.51 43.94,49.78 43.18,50.55 42.93,50.55 RU1.1 | v36.32,33.78 36.32,30.99 38.1,29.21
  Bottom 0.152: v44.2,48.26 44.2,41.66 v36.32,33.78
GND  (via drill 0.33)
  Top 0.152: 52.32,43.94 52.32,41.91 48.01,37.59 48.01,37.08 v45.21,34.29 44.45,33.53 X2.GND | 52.32,43.94 50.29,45.97 B3.2 | 52.32,43.94 52.32,52.58 51.56,53.34 51.56,54.86 50.29,56.13 50.29,56.64 B2.2 | IC3.23 11.18,19.05 9.65,20.57 C7.2 8.64,20.57 8.64,16.76 | 8.64,16.76 8.89,16.76 10.92,14.73 | 8.64,16.76 8.13,16.76 IC4.1 | IC3.33 16.76,13.21 14.22,10.67 14.73,10.16 RST.A' | 9.14,2.29 9.65,2.79 9.65,3.81 RTHM.1 | 9.14,2.29 8.64,1.78 6.86,1.78 6.1,2.54 6.1,2.79 C9.2 | NKA1.8 17.27,2.29 16.51,3.05 14.73,3.05 RST.A 14.48,3.05 12.7,1.27 9.91,1.27 9.14,2.03 9.14,2.29 | RST.A' 14.73,9.91 14.73,8.38 17.27,5.84 NKA.8 | 10.92,14.73 10.92,13.72 14.48,10.16 RST.A' | 10.92,14.73 C2.2 | 17.27,58.17 18.29,57.15 18.29,56.9 19.05,56.13 20.07,56.13 21.59,54.61 WS8.S 21.84,54.61 23.37,54.61 v23.62,54.36 | 17.27,58.17 16.76,58.67 16.51,58.67 C1.2 | 17.27,58.17 19.05,59.94 14.73,64.26 14.73,64.52 13.46,65.79 B1.2 | 40.64,58.67 40.64,59.94 38.1,62.48 34.54,62.48 RAD.1 | 40.64,58.67 40.64,58.17 Q4.2 40.64,58.67 | 40.64,58.67 36.07,58.67 32.77,61.98 25.65,61.98 23.88,63.75 23.88,66.04 22.86,67.06 Q1.2 | 16,43.43 15.75,43.69 WS10.S 16,43.43 | 16,43.43 16.51,42.93 16.51,42.42 18.29,40.64 18.29,38.1 WS1.S 18.54,37.85 v19.56,36.83 21.34,36.83 21.59,36.58 22.1,36.58 23.11,35.56 | 23.11,35.56 23.88,34.8 24.13,34.8 WS2.S | 23.11,35.56 30.48,35.56 WS3.S | 33.27,50.04 36.83,46.48 WS5.S | 33.27,50.04 32.51,50.8 | 32.51,50.8 28.19,55.12 28.19,55.37 WS7.S | 32.51,50.8 33.78,52.07 WS6.S | v19.05,48.77 17.78,50.04 17.02,50.04 WS9.S | 29.72,44.96 28.7,45.97 JP6.2 | 29.72,44.96 32.51,42.16 | 32.51,42.16 34.54,40.13 35.31,40.13 WS4.S
  Top 0.152: 29.72,44.96 25.65,44.96 24.89,45.72 24.89,46.74 23.62,48.01 23.62,48.51 JP3.2 | 33.27,50.04 32.51,49.28 32.51,42.16 | v16.76,44.2 16,43.43 | v26.42,23.88 IC2.2 | v23.11,19.81 24.64,18.29 IC3.43 24.89,18.29 25.91,17.27 28.45,17.27 | v19.05,14.99 20.07,13.97 IC3.35 | v23.11,19.81 23.62,20.32 23.62,21.34 22.1,22.86 22.86,23.62 IC3.5 | v14.73,33.27 14.99,33.02 15.75,33.02 C4.2 | v11.43,30.73 10.41,29.72 10.16,29.97 | 1.78,48.51 1.78,49.02 EEPRM.1 | 1.78,48.51 1.78,48.01 EEPRM.2 1.78,47.75 1.78,46.74 EEPRM.3 1.78,46.48 1.78,45.47 EEPRM.4 1.78,45.21 3.05,45.21 4.57,43.69 4.57,38.61 4.83,38.35 | 1.78,48.51 4.06,48.51 4.57,48.01 6.86,48.01 EEPRM.7 | 4.57,34.8 5.84,33.53 JP4.1 6.1,33.27 9.4,29.97 10.16,29.97 | 4.57,34.8 4.32,35.05 2.54,35.05 1.02,33.53 1.02,32 2.03,30.99 RC.1 | 4.83,38.35 7.62,38.35 USB.2 | 4.83,38.35 4.06,37.59 4.57,37.08 4.57,34.8 | 10.16,29.97 C6.2 10.16,28.96 11.94,27.18 C3.2 12.19,26.92 12.95,26.16 14.48,26.16 14.99,25.65 15.24,25.65 IC3.15 15.49,25.4 21.08,19.81 v23.11,19.81 | NKA.2 32.51,13.21 28.45,17.27 | 28.45,17.27 BAT1.P$1
  Bottom 0.152: 45.21,24.64 45.47,24.64 MICROSD.P$2 45.21,24.64 | 45.21,24.64 40.64,24.64 | 40.64,24.64 36.32,24.64 MICROSD.GND1 | 40.64,24.64 36.07,20.07 35.56,20.07 MICROSD.6 35.31,19.81 34.8,19.81 32.77,17.78 32.77,17.53 32.26,17.02 31.24,17.02 26.16,11.94 23.37,11.94 17.27,5.84 NKA.8 NKA1.8 17.27,2.03 18.03,2.03 19.56,0.51 28.19,0.51 29.97,2.29 NKA1.3 29.97,3.05 32.51,5.59 NKA.2 32.51,5.84 35.81,9.14 | 45.21,24.64 v45.21,34.29 | B1.2 13.21,65.53 10.67,65.53 4.83,59.69 JP2.4 | 20.07,47.75 20.32,47.5 20.57,47.75 22.61,47.75 JP3.2 25.4,50.55 26.42,50.55 26.67,50.8 27.18,50.8 28.7,52.32 28.7,52.83 29.46,53.59 27.18,55.88 27.18,56.9 | 20.07,47.75 v19.05,48.77 | v16.76,44.2 16.76,44.45 20.07,47.75 | 27.18,56.9 RAD.1 | v23.62,54.36 24.13,54.36 25.15,55.37 25.65,55.37 27.18,56.9 | 35.81,9.14 35.81,9.91 MICROSD.GND3 35.81,9.14 | 35.81,9.14 45.47,9.14 MICROSD.P$1 45.72,9.14 47.24,7.62 47.24,4.57 46.23,3.56 ISP.6 | v26.42,23.88 26.42,23.11 v23.11,19.81 19.05,15.75 v19.05,14.99 | v11.43,30.73 13.97,33.27 v14.73,33.27 18.29,36.83 v19.56,36.83
MISO  (via drill 0.33)
  Top 0.152: v32,17.78 32,14.22 ISP.1 | v10.41,36.07 11.68,34.8 11.68,34.29 15.49,30.48 16,30.48 18.29,28.19 18.29,27.69 18.8,27.18 19.56,27.18 IC3.11 | v50.8,54.61 49.53,55.88 47.75,55.88 46.23,57.4 46.23,61.47 v41.91,65.79
  Bottom 0.152: v32,17.78 34.29,20.07 34.29,20.57 34.8,21.08 35.31,21.08 MICROSD.7 | v10.41,36.07 8.89,36.07 8.38,35.56 6.1,35.56 4.32,37.34 4.32,45.97 4.83,46.48 4.83,47.24 5.08,47.5 5.08,48.77 7.11,50.8 7.62,50.8 17.53,60.71 18.8,60.71 22.35,64.26 22.61,64.26 | 22.61,64.26 25.15,64.26 RAD.7 | ISP.1 41.15,4.06 40.13,3.05 40.13,2.03 41.66,0.51 45.72,0.51 47.24,2.03 47.24,4.06 50.04,6.86 50.04,39.12 52.07,41.15 52.07,53.34 v50.8,54.61 | v41.91,65.79 39.62,68.07 26.42,68.07 22.61,64.26
MOSI  (via drill 0.33)
  Top 0.152: v18.8,29.46 20.83,27.43 20.32,26.92 IC3.10 | v13.21,21.59 13.21,20.83 v17.27,16.76 | v31.75,28.96 31.75,27.18 v39.12,19.81 44.96,13.97 44.96,13.21 50.55,7.62 46.99,4.06 45.97,4.06 44.45,2.54 ISP.4 | v33.27,49.02 33.27,44.96 35.56,42.67 36.07,42.67 36.32,42.42 37.34,42.42 v40.13,39.62
  Bottom 0.152: v18.8,29.46 18.54,29.46 17.27,28.19 17.27,26.67 16.51,25.91 16.51,25.15 13.21,21.84 v13.21,21.59 | v17.27,16.76 34.29,33.78 35.05,33.78 | 35.05,33.78 35.81,33.02 v31.75,28.96 | v39.12,19.81 36.32,17.02 35.81,17.02 35.56,16.76 MICROSD.3 | v33.27,49.02 37.08,52.83 37.08,61.98 41.15,66.04 39.62,67.56 38.86,67.56 38.61,67.31 30.73,67.31 29.46,66.04 28.7,66.04 RAD.6 | v40.13,39.62 40.13,38.86 35.05,33.78
N$1  (via drill 0.33)
  Top 0.152: 7.11,14.99 5.08,14.99 2.03,18.03 SWITCH.3 | v10.41,16.26 11.18,16.26 12.45,14.99 12.45,13.97 C2.1 | 7.11,14.99 v9.14,14.99 | 7.11,14.99 IC4.3
  Bottom 0.152: v9.14,14.99 v10.41,16.26
N$2  (via drill 0.33)
  Top 0.152: 8.38,22.1 6.86,20.57 C7.1 | 8.38,22.1 7.37,23.11 X3.P$1 | v16,23.37 14.99,24.38 14.99,24.89 IC3.16 | v13.72,19.3 12.7,19.3 11.94,20.07 10.92,20.07 9.4,21.59 8.89,21.59 8.38,22.1
  Bottom 0.152: v16,23.37 16,21.59 v13.72,19.3
N$3  (via drill 0.33)
  Top 0.152: v8.89,31.75 10.16,31.75 C6.1 | 8.64,28.7 7.37,27.43 X3.P$2 | 8.64,28.7 v8.89,28.96 | 8.64,28.7 8.89,28.7 12.7,24.89 13.46,24.89 13.72,24.64 13.97,24.64 IC3.17
  Bottom 0.152: v8.89,28.96 v8.89,31.75
N$4
  Top 0.152: WS10.I 12.7,42.93 12.7,43.69 13.46,44.45 13.46,45.47 14.99,46.99 15.49,46.48 WS9.O
N$5  (via drill 0.33)
  Top 0.152: v25.15,26.67 25.4,26.42 25.4,25.4 IC2.1 | v51.82,56.64 51.82,58.67 48.51,61.98 PWR.C
  Bottom 0.152: v25.15,26.67 25.15,27.43 26.67,28.96 26.67,31.24 31.75,36.32 31.75,37.08 44.96,50.29 44.96,50.55 47.24,52.83 48.01,52.83 v51.82,56.64
N$6  (via drill 0.33)
  Top 0.152: v23.62,30.23 25.4,28.45 25.4,28.19 IC2.5 | v11.18,23.37 9.91,23.37 8.64,24.64 7.37,24.64 5.84,26.16 5.84,28.7 4.57,29.97 4.57,30.99 4.06,31.5 3.3,31.5 2.03,32.77 RC.2
  Bottom 0.152: v23.62,30.23 18.54,30.23 16.76,28.45 16.76,27.94 12.19,23.37 v11.18,23.37
N$7  (via drill 0.33)
  Top 0.152: v41.66,59.94 Q4.3 | U$1.- v41.66,62.74
  Bottom 0.152: v41.66,62.74 v41.66,59.94
N$8  (via drill 0.33)
  Top 0.152: IR9.C 14.22,44.96 v14.22,43.94 14.22,40.13 16.26,38.1 IR10.C | v16,50.8 16,52.32 IR8.C | v21.34,56.9 21.59,56.64 22.35,56.64 IR7.C | v27.69,29.72 23.88,33.53 22.35,33.53 IR1.C | v30.99,33.02 30.73,33.02 29.97,33.78 IR2.C | IR3.C 36.07,37.85 v35.31,37.08 34.04,35.81 32.51,37.34 v32.51,39.37 | Q1.3 20.83,66.29 20.83,64.26 v24.89,60.2 27.18,57.91 27.94,57.91 28.96,56.9 29.72,56.9 29.97,56.64 IR6.C 30.23,56.64 31.5,56.64 35.81,52.32 IR5.C 36.07,52.07 37.85,50.29 37.85,47.5 38.61,46.74 38.61,45.21 IR4.C 38.61,44.96 v37.85,44.2
  Bottom 0.152: v14.22,43.94 16,45.72 v16,50.8 20.57,55.37 20.57,56.13 v21.34,56.9 21.59,56.9 v24.89,60.2 | v27.69,29.72 v30.99,33.02 35.05,37.08 v35.31,37.08 | v32.51,39.37 33.02,39.37 v37.85,44.2
N$10  (via drill 0.33)
  Top 0.152: v46.99,60.71 46.74,62.99 PWR.A | v44.7,57.91 44.7,54.61 44.96,54.36 RE1.1
  Bottom 0.152: v46.99,60.71 46.99,60.2 v44.7,57.91
N$11
  Top 0.152: IR1.A 22.1,32.26 22.1,29.97 IRR1.1
N$12
  Top 0.152: NKA.7 19.81,5.84 20.32,5.84 21.84,4.32 33.27,4.32 35.05,2.54 NKA1.1
N$13  (via drill 0.33)
  Top 0.152: v31.24,32 30.99,32.26 30.23,32.26 IR2.A | v28.96,29.97 30.23,29.97 IRR2.1
  Bottom 0.152: v31.24,32 30.99,32 v28.96,29.97
N$14  (via drill 0.33)
  Top 0.152: v31.24,55.88 31.5,55.63 30.73,54.86 WS6.O | v29.21,57.66 28.19,58.67 WS7.I
  Bottom 0.152: v31.24,55.88 29.46,57.66 v29.21,57.66
N$15
  Top 0.152: IR3.A 37.59,36.83 37.59,36.07 38.35,35.31 IRR3.1
N$16
  Top 0.152: IR6.A 30.48,57.66 30.99,57.66 32.51,56.13 33.27,56.13 34.29,57.15 32,59.44 IRR6.1
N$17
  Top 0.152: IR4.A 40.13,45.21 41.4,46.48 41.91,45.97 IRR4.1
N$18
  Top 0.152: IR5.A 37.34,53.09 38.86,54.61 38.35,55.12 IRR5.1
N$19  (via drill 0.33)
  Top 0.152: v35.81,44.96 36.58,44.2 36.58,43.94 WS4.O | v38.61,47.75 39.37,47.75 39.62,47.5 WS5.I
  Bottom 0.152: v38.61,47.75 v35.81,44.96
N$20  (via drill 0.33)
  Top 0.152: v34.04,50.8 34.54,50.29 35.31,50.29 WS5.O | v35.05,54.1 35.81,54.86 WS6.I
  Bottom 0.152: v34.04,50.8 34.04,53.09 v35.05,54.1
N$21  (via drill 0.33)
  Top 0.152: v28.96,19.81 25.15,23.62 24.89,23.62 24.38,24.13 23.62,23.37 IC3.4 | v31.5,22.35 31.5,22.61 v28.7,25.4 | v37.08,33.27 37.08,32 37.34,31.75 RD+1.2
  Bottom 0.152: v31.5,22.35 v28.96,19.81 | v28.7,25.4 29.21,25.4 v37.08,33.27
N$22  (via drill 0.33)
  Top 0.152: v27.43,20.32 26.16,21.59 26.16,22.1 25.15,23.11 24.89,23.11 24.64,23.37 24.13,22.86 IC3.3 | v35.31,28.19 36.58,26.92 38.35,26.92 39.37,27.94 RD-1.2
  Bottom 0.152: v35.31,28.19 v27.43,20.32
N$23
  Top 0.152: WS1.O 21.59,35.31 21.59,33.78 21.34,33.53 21.84,33.02 22.35,33.02 24.13,31.24 WS2.I
N$24  (via drill 0.33)
  Top 0.152: v29.21,32.77 28.19,33.78 28.19,34.54 WS2.O | v30.99,34.04 31.24,34.04 32.51,32.77 WS3.I
  Bottom 0.152: v29.21,32.77 29.72,32.77 v30.99,34.04
N$25
  Top 0.152: WS3.O 34.04,38.1 35.31,38.1 37.34,40.13 38.35,39.12 WS4.I
N$26
  Top 0.152: IR7.A 22.1,57.91 20.57,59.44 IRR7.1
N$27
  Top 0.152: WS9.I 13.97,51.31 16.51,53.85 18.29,52.07 WS8.O
N$28  (via drill 0.33)
  Top 0.152: v21.34,55.88 19.81,57.4 WS8.I | v23.62,56.64 23.62,56.13 24.13,55.63 WS7.O
  Bottom 0.152: v21.34,55.88 22.86,55.88 v23.62,56.64
N$29
  Top 0.152: IR8.A 14.73,53.34 13.21,53.34 IRR8.1
N$30
  Top 0.152: IR9.A 10.92,44.96 10.41,44.45 IRR9.1
N$31
  Top 0.152: T1.1 21.59,10.67 21.59,6.6 22.35,5.84 NKA.6
  Bottom 0.152: NKA1.7 19.81,3.05 22.35,5.59 NKA.6
N$32
  Top 0.152: IR10.A 14.99,37.08 13.46,35.56 13.97,35.05 IRR10.1
RESET  (via drill 0.33)
  Top 0.152: v20.07,21.84 20.07,23.37 16.76,26.67 16.51,26.67 IC3.13 | v10.92,12.45 10.92,10.16 RST.B' | ISP.5 45.72,5.08 32.26,18.54 31.75,18.54 30.48,19.81 29.97,19.81 29.21,20.57 28.7,20.57 v24.38,24.89 | v7.11,8.89 10.67,5.33 10.67,3.3 RST.B
  Bottom 0.152: 20.07,21.59 v10.92,12.45 7.37,8.89 v7.11,8.89 | v24.38,24.89 23.37,24.89 20.07,21.59 | 20.07,21.59 v20.07,21.84
RX
  Top 0.152: JP2.7 2.29,54.36 3.3,54.36 4.32,53.34 7.37,53.34 11.94,48.77 15.49,48.77 17.02,47.24 17.02,46.74 22.35,41.4 22.35,39.62 23.62,38.35 JP5.4
  Bottom 0.152: JP1.4 28.45,40.89 26.42,42.93 25.65,42.16 25.4,42.16 24.89,41.66 24.89,39.62 23.62,38.35 JP5.4
SCK  (via drill 0.33)
  Top 0.152: 19.81,25.15 19.3,24.64 v22.86,21.08 | 19.81,25.15 20.57,25.91 IC3.9 | v28.96,27.43 29.21,27.43 v36.83,19.81 | ISP.3 43.69,6.1 v34.04,15.75 | v28.45,53.59 28.45,51.05 v28.7,50.8 | 19.81,25.15 v19.3,25.65
  Bottom 0.152: v22.86,21.08 22.86,21.84 27.94,26.92 28.45,26.92 v28.96,27.43 | v36.83,19.81 36.32,19.3 35.81,19.3 35.56,19.05 MICROSD.5 35.31,18.8 35.05,18.54 34.54,18.54 34.04,18.03 v34.04,15.75 | v28.45,53.59 26.92,55.12 25.91,55.12 25.65,54.86 25.15,54.86 23.62,53.34 22.86,54.1 22.86,54.61 28.45,60.2 28.45,63.25 RAD.5 | v28.7,50.8 29.97,49.53 29.97,35.56 23.88,29.46 23.11,29.46 v19.3,25.65
SCL  (via drill 0.33)
  Top 0.152: RSCL.1 6.35,64.77 5.59,64.77 3.56,62.74 3.56,60.96 2.29,59.69 JP2.3 2.29,59.44 0.51,57.66 0.51,54.1 1.02,53.59 1.02,51.56 2.79,49.78 3.3,49.78 4.57,48.51 8.13,48.51 8.89,47.75 7.87,46.74 | 7.87,46.74 7.11,46.74 EEPRM.6 7.87,46.74 | v10.92,25.65 11.68,24.89 12.19,24.89 13.21,23.88 13.46,23.88 IC3.18 | v13.21,29.72 v13.21,31.24 v8.13,36.32 | JP5.2 28.7,38.1 26.67,36.07 24.89,37.85 24.89,39.37 23.62,40.64 JP1.2 | 7.87,46.74 7.87,46.23 8.38,45.72 8.38,44.2 v11.94,40.64
  Bottom 0.152: v10.92,25.65 10.92,27.43 v13.21,29.72 | v13.21,31.24 13.72,31.24 17.27,34.8 19.3,34.8 22.35,37.85 22.35,39.62 23.37,40.64 JP1.2 | v11.94,40.64 11.94,40.13 v8.13,36.32
SDA  (via drill 0.33)
  Top 0.152: v9.91,62.99 9.91,65.79 8.89,66.8 RSDA.1 | v3.81,47.75 5.33,46.23 | 5.33,46.23 6.1,45.47 6.86,45.47 EEPRM.5 | v11.94,24.13 12.7,23.37 12.95,23.37 IC3.19 | JP5.3 26.16,40.89 JP1.3 | v5.33,45.97 5.33,46.23 | v5.08,37.59 5.33,37.59 v9.91,33.02 | v20.57,33.78 v17.27,37.08
  Bottom 0.152: v9.91,62.99 5.33,58.42 3.56,58.42 | 3.56,58.42 2.29,57.15 JP2.5 | v3.81,47.75 3.81,51.31 3.56,51.56 3.56,58.42 | 21.08,33.27 26.16,38.35 JP5.3 | 21.08,33.27 v11.94,24.13 | v5.33,45.97 5.33,37.85 v5.08,37.59 | v9.91,33.02 13.21,33.02 v17.27,37.08 | 21.08,33.27 v20.57,33.78
TX  (via drill 0.33)
  Top 0.152: v3.56,46.74 5.59,44.7 6.86,44.7 v12.19,39.37 | v17.27,42.67 17.27,42.42 21.08,38.61 JP5.5 | v28.19,43.43 30.48,41.15 30.99,41.15 JP1.5
  Bottom 0.152: JP2.9 2.29,48.01 v3.56,46.74 | v12.19,39.37 13.97,39.37 v17.27,42.67 | v28.19,43.43 22.1,43.43 21.59,42.93 21.08,42.93 19.81,41.66 19.81,39.88 21.08,38.61 JP5.5
VBAT  (via drill 0.33)
  Top 0.152: v11.18,38.35 9.14,40.39 7.87,40.39 USB.1 | v38.35,13.46 v29.97,21.84 27.43,24.38 27.43,25.15 IC2.3 | v47.75,17.27 49.02,18.54 BAT1.P$2 | SWITCH.2 2.03,19.81 0.51,18.29 1.02,17.78 1.02,17.53 1.52,17.02 2.54,17.02 4.06,15.49 4.06,14.48 v9.4,9.14
  Bottom 0.152: SWITCH.2 2.03,22.61 3.05,23.62 3.05,25.65 4.06,26.67 4.06,28.7 JP4.2 11.18,35.81 v11.18,38.35 | v38.35,13.46 43.94,13.46 v47.75,17.27 | v9.4,9.14 11.18,9.14 14.73,5.59 24.13,14.99 24.13,16 v29.97,21.84
VBUS  (via drill 0.33)
  Top 0.152: v25.91,29.21 26.92,28.19 27.18,28.19 IC2.4 27.43,27.94 v31.75,23.62 45.97,9.4 v45.97,7.87 | v20.83,24.13 21.59,24.89 IC3.7 | v40.89,32.26 42.93,30.23 44.2,30.23 X2.VBUS | v13.97,64.26 16.26,61.98 16.26,60.71 C1.1 16.51,60.45 17.02,60.45 v17.78,59.69 | v45.72,55.63 46.74,54.61 46.74,54.36 RE1.2 | 23.11,51.05 JP3.1 | 23.11,51.05 24.89,49.28 24.89,48.51 25.65,47.75 27.94,47.75 28.19,47.5 30.23,47.5 31.24,46.48 JP6.1 | v17.53,56.9 17.53,56.64 23.11,51.05 | v49.53,49.78 51.82,52.07 51.82,52.58 v49.28,55.12
  Bottom 0.152: v20.83,24.13 v25.91,29.21 | v31.75,23.62 40.39,32.26 v40.89,32.26 40.89,34.29 46.23,39.62 46.23,48.26 46.99,49.02 48.77,49.02 v49.53,49.78 | ISP.2 41.15,3.56 42.16,4.57 42.16,5.08 43.18,6.1 44.2,6.1 v45.97,7.87 | v13.97,64.26 13.97,64.77 14.48,65.28 14.48,66.29 13.21,67.56 10.41,67.56 4.83,61.98 JP2.2 | v45.72,55.63 40.89,55.63 33.53,48.26 33.02,48.26 32.26,47.5 | 32.26,47.5 31.24,46.48 JP6.1 | v17.78,59.69 17.78,57.15 v17.53,56.9 | v49.28,55.12 48.01,55.12 38.1,45.21 37.08,45.21 36.07,44.2 35.56,44.2 32.26,47.5
VCC  (via drill 0.33)
  Top 0.152: 10.67,46.48 11.94,47.75 12.45,47.24 WS9.D | 10.67,46.48 10.41,46.23 IRR9.2 10.67,46.48 | 10.67,46.48 8.13,49.02 7.11,49.02 EEPRM.8 6.86,49.28 5.84,49.28 3.56,51.56 3.56,52.58 2.79,53.34 1.78,53.34 1.02,54.1 1.02,55.12 1.78,55.88 5.84,55.88 | WS8.D 16.26,55.12 14.48,55.12 IRR8.2 14.22,55.37 8.89,55.37 | 8.89,55.37 6.35,55.37 5.84,55.88 | 5.84,55.88 4.83,56.9 JP2.6 | 8.89,55.37 8.89,65.02 RSDA.2 8.64,65.28 8.13,65.28 6.6,66.8 RSCL.2 6.6,67.06 7.62,68.07 9.65,68.07 10.67,67.06 13.72,67.06 17.27,63.5 17.27,62.74 19.05,60.96 20.83,60.96 21.34,60.45 22.1,60.45 IRR7.2 22.35,60.2 22.86,60.2 24.13,58.93 WS7.D 24.38,58.67 25.91,58.67 v27.94,56.64 | v39.12,66.8 44.2,66.8 U$1.+ | 14.48,38.35 12.95,36.83 IRR10.2 | 14.48,38.35 13.97,38.86 WS10.D 14.48,38.35 | 18.54,32.51 19.05,33.02 19.56,32.51 WS1.D | 18.54,32.51 17.78,31.75 C4.1 17.78,31.5 23.62,25.65 IC3.6 | 20.32,31.75 20.32,32 19.81,32.51 WS1.D | 20.32,31.75 20.32,30.73 IRR1.2 | 14.48,38.35 14.99,38.35 18.03,35.31 18.03,34.54 19.81,32.77 WS1.D | IC3.14 15.75,26.16 13.97,27.94 13.46,27.94 C3.1 13.46,28.19 v14.22,28.96 | v6.1,15.75 6.1,16.76 IC4.2 | C9.1 7.62,2.79 7.62,4.57 7.11,5.08 7.11,6.35 3.05,10.41 THM1.2 | v10.16,18.29 10.92,17.53 11.68,18.29 IC3.24 | 18.54,32.51 18.29,32.51 v17.78,33.02 | 40.13,42.42 39.88,42.67 WS4.D 40.13,42.42 | 40.13,42.42 42.67,39.88 39.88,37.08 IRR3.2 39.62,36.83 40.64,35.81 38.86,34.04 38.35,34.04 37.34,35.05 36.07,35.05 WS3.D 35.81,35.05 35.81,34.29 35.31,33.78 35.56,33.53 35.56,32.51 32.77,29.72 | 40.13,42.42 41.91,44.2 IRR4.2 41.91,44.45 42.67,44.45 44.2,45.97 41.15,49.02
  Top 0.152: WS6.D 32.51,57.66 31.5,58.67 30.99,58.67 30.23,59.44 30.23,60.2 IRR6.2 30.23,60.45 30.99,60.45 32,61.47 32.77,61.47 33.02,61.21 | 41.15,49.02 40.64,49.02 38.61,51.05 WS5.D 38.35,51.31 37.85,51.82 39.37,53.34 IRR5.2 39.62,53.59 39.62,55.37 36.83,58.17 36.07,58.17 33.02,61.21 | 41.15,49.02 42.93,49.02 RU1.2 | 23.88,9.91 24.89,10.92 25.15,10.67 T2.2 25.4,10.67 26.92,9.14 28.19,10.41 28.19,12.45 25.65,14.99 25.65,16 24.13,17.53 24.13,17.78 IC3.42 23.88,18.03 v23.11,18.8 | 23.88,9.91 22.61,8.64 T1.2 | 23.88,9.91 20.83,12.95 20.32,12.95 20.07,13.21 19.81,13.21 IC3.34 | v24.13,19.81 24.89,19.05 25.15,19.05 IC3.44 | 32.77,29.72 32,30.48 IRR2.2 32,30.73 31.24,30.73 30.73,31.24 28.19,31.24 WS2.D 27.94,31.5 26.92,32.51 v25.91,32.51 | 32.77,29.72 v33.78,28.7 v40.39,22.1 v50.8,11.68 | v20.83,31.75 20.32,31.75 | 33.02,61.21 v32.77,60.96
  Bottom 0.152: JP6.3 26.16,48.77 JP3.3 26.16,49.02 26.16,49.28 29.21,52.32 29.21,52.83 30.48,54.1 | 38.86,66.8 34.54,66.8 RAD.2 | 30.48,54.1 32,55.63 32,59.94 33.02,60.96 | 38.86,66.8 33.02,60.96 | 38.86,66.8 v39.12,66.8 | 30.48,54.1 v27.94,56.64 | 6.1,15.24 6.1,13.72 3.05,10.67 THM1.2 | 6.1,15.24 v6.1,15.75 | v10.16,18.29 9.14,18.29 6.6,15.75 | 6.1,15.24 6.6,15.75 | 6.6,15.75 6.6,19.05 9.91,22.35 9.91,23.62 14.22,27.94 v14.22,28.96 14.22,29.21 17.78,32.77 v17.78,33.02 | v23.11,18.8 v24.13,19.81 28.96,24.64 29.72,24.64 v33.78,28.7 | v50.8,11.68 50.8,7.87 RSD.2 | v40.39,22.1 36.32,18.03 35.56,18.03 MICROSD.4 | v20.83,31.75 25.15,31.75 v25.91,32.51 | v32.77,60.96 33.02,60.96

### Text on the board
tNames: PUBLIC | ***** | LAB | OPEN | .org | LUX | **** | REV-Q | VBUS | GND | A0 | A1 | VCC | A2 | SCL | SDA | RX | TX | USB | GND | VBAT
bNames: (X) | MOSI | A4 | VCC | Hardware License | A2 | GND | MISO | SCK | A5 | GND | A1 | VCC | CERN Open | Ver. 1.1 | A0 | VBUS | TX | SCL | RX | SDA | A1 | A0 | VCC | VBUS | GND | TX | RX | SDA | SCL | A2 | PUBLICLAB.ORG/WIKI/OPEN-LUX | GND | LED | LCD | D8 | D9 | A3 | GND | A4 | GND | LCD | D8 | D9 | A3 | GND | A4 | LED | SCK | MISO | RST | VBUS | GND | MOSI